# EAGLE design Debouncer (EAGLE 9.5.2)
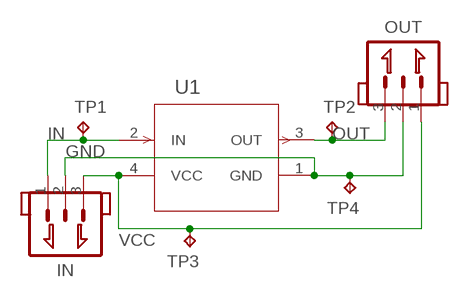
[diagram p0: schematic, sheet 1]

## Parts
IN  JST_1.25_3P  [JST1.25_3P]
OUT  JST_1.25_3P  [JST1.25_3P]
TP1  TPPAD1-13  [P1-13]
TP2  TPPAD1-13  [P1-13]
TP3  TPPAD1-13  [P1-13]
TP4  TPPAD1-13  [P1-13]
U1  DEBOUNCE_MAX6816EUS+T  [21-0052F]

## Nets
GND: IN.2 OUT.2 TP4.TP U1.1(GND)
IN: IN.1 TP1.TP U1.2(IN)
OUT: OUT.3 TP2.TP U1.3(OUT)
VCC: IN.3 OUT.1 TP3.TP U1.4(VCC)

## Library data of the parts
IN OUT = Scott-Connectors:JST_1.25_3P
TP1-TP4 = testpad:TP: Test pad
U1 = Scott-ICs:DEBOUNCE_MAX6816EUS+T; BUILT_BY: EMA_UL_Team; MANUFACTURER_PART_NUMBER: MAX6816EUS+T; VENDOR: Maxim Integrated Products

## Board
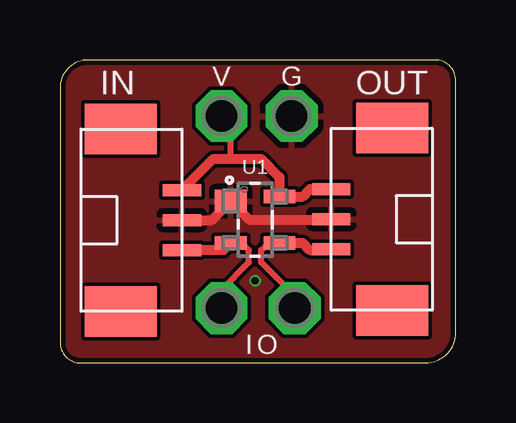
[diagram p1: board, top side]
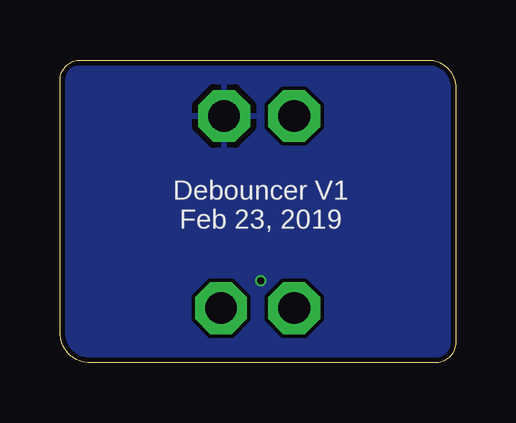
[diagram p2: board, bottom side, seen from below]

Size 16.49 x 12.62 mm. Coordinates in mm from the lower left corner, seen from the top.
Outline: 0,11.47 0,0.87 arc90 0.87,0 15.22,0 arc90 16.49,1.27 16.49,11.78 arc90 15.65,12.62 1.15,12.62 arc90 0,11.47
Copper layers (1*16): Top 0.035559375mm / dielectric 1.6mm / Bottom 0.035559375mm
Design rules "jlcpcb2layer": minimum track width 5mil, minimum drill 12mil, track to track 5mil, track to pad 5mil, pad to pad 5mil, via to via 5mil, smd to smd 5mil, copper to edge 8mil, drill to drill 6mil, minimum pad ring 5mil, minimum via ring 3mil, stop-mask expansion 2.5mil, vias tented up to drill 20mil, thermal gap 10mil

### Footprints (pad centres in the part's own frame; a part is rotated, then mirrored left to right if it is on the bottom)
JST1.25_3P = smd 0.5 x 1.6: 1 0,0; 2 1.25,0; 3 2.5,0 | smd 2.1 x 3: 4 -2.55,2.55; 5 5.05,2.55
P1-13 = drill 1.321 pad 2.159 octagon: TP 0,0
21-0052F = smd 0.94 x 1.321: 1 -0.775,-1.016 | smd 0.559 x 1.321: 2 0.965,-1.016; 3 0.965,1.016; 4 -0.965,1.016

### Placement (x,y rotation side)
IN  5.08,4.7 90 top
OUT  11.3,7.24 270 top
TP1  6.73,2.29 0 top
TP2  9.78,2.29 0 top
TP3  6.73,10.29 0 top
TP4  9.65,10.29 0 top
U1  8.13,5.97 270 top

### Tracks (layer width: path | path; a pad name or v marks a point on that pad's centre or on a via)
GND  (via drill 0.3)
  Top 0.406: IN.2 6.32,5.95 U1.1 7.89,5.97 11.28,5.97 OUT.2
  other vias: 8.13,3.43
  pour Top (isolate 0.152, rank 6): -0.25,13.08 17.02,13.08 17.02,-1.02 -0.38,-1.02 -0.38,13.08
  pour Bottom (isolate 0.152, rank 6): -0.38,13.21 17.02,13.21 17.02,-1.02 -0.38,-1.02
IN
  Top 0.254: TP1.TP 6.73,3.05 7.87,4.19 7.87,4.7 7.57,5 U1.2
  Top 0.406: U1.2 6.81,4.7 IN.1
OUT
  Top 0.254: TP2.TP 9.78,2.79 8.38,4.19 8.38,4.7 8.69,5 U1.3
  Top 0.406: U1.3 10.11,5 10.41,4.7 11.26,4.7 OUT.3
VCC
  Top 0.254: 7.11,8.51 7.11,9.91 TP3.TP
  Top 0.406: IN.3 6.39,8.51 7.11,8.51 8.38,8.51 9.14,7.75 U1.4 10.11,6.93 10.41,7.24 OUT.1

### Text on the board
tPlace: V | G | I | O
bPlace: Debouncer V1 / Feb 23, 2019